# EAGLE schematic lab5 (EAGLE 9.6.2)
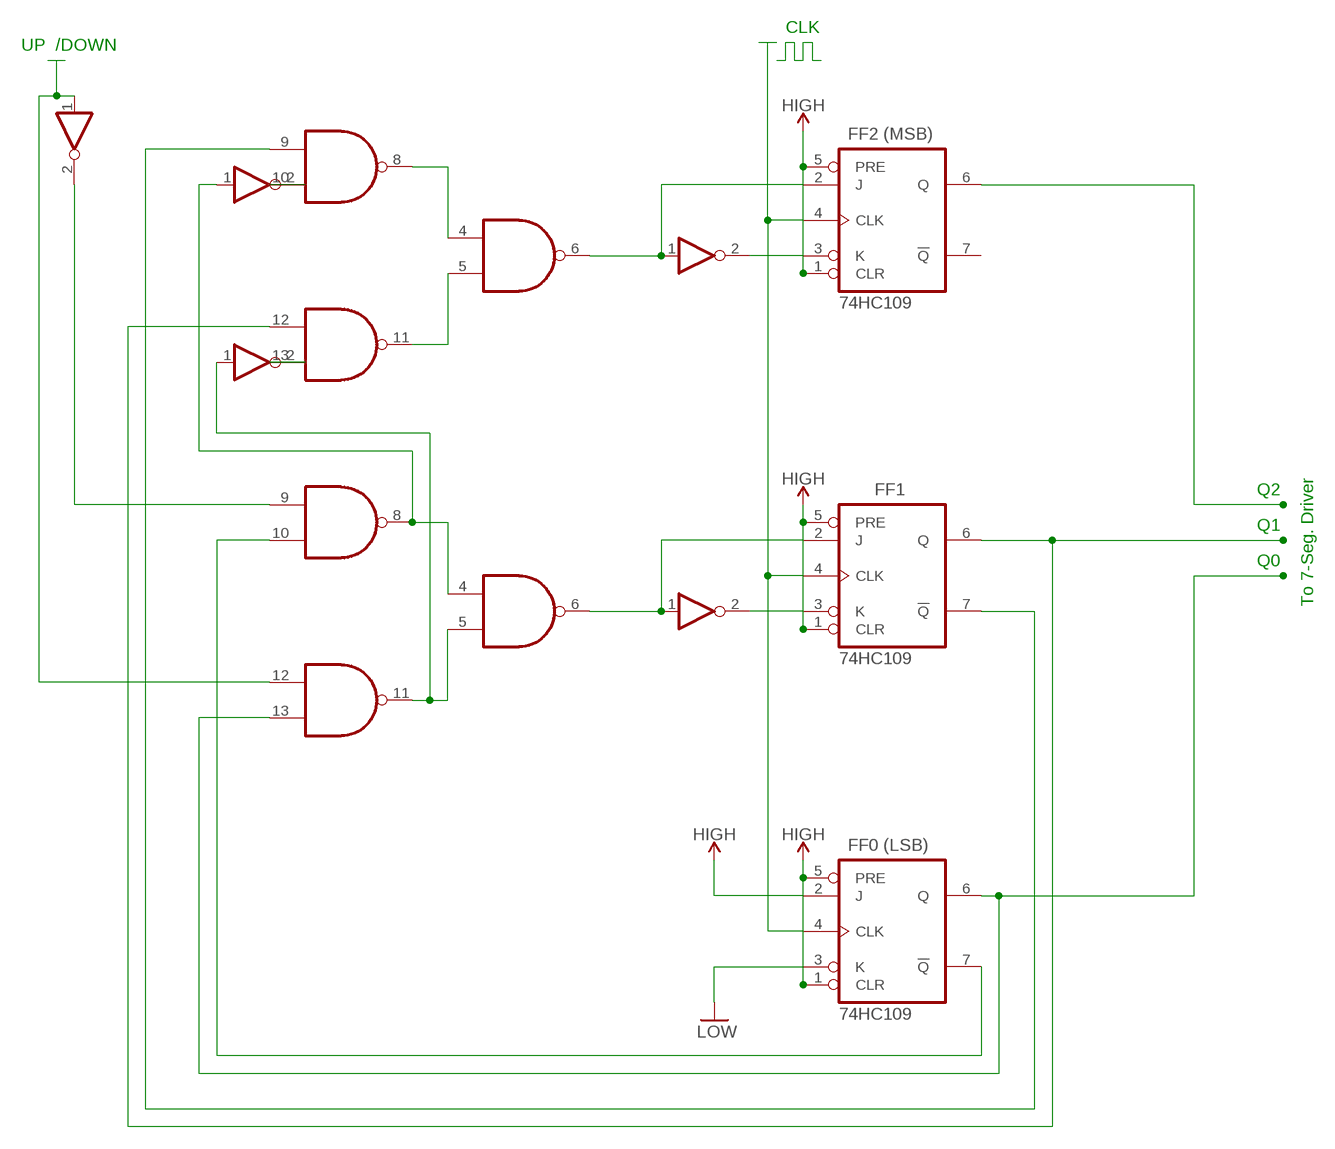
[diagram p0: schematic, sheet 1, part 1 of 2]
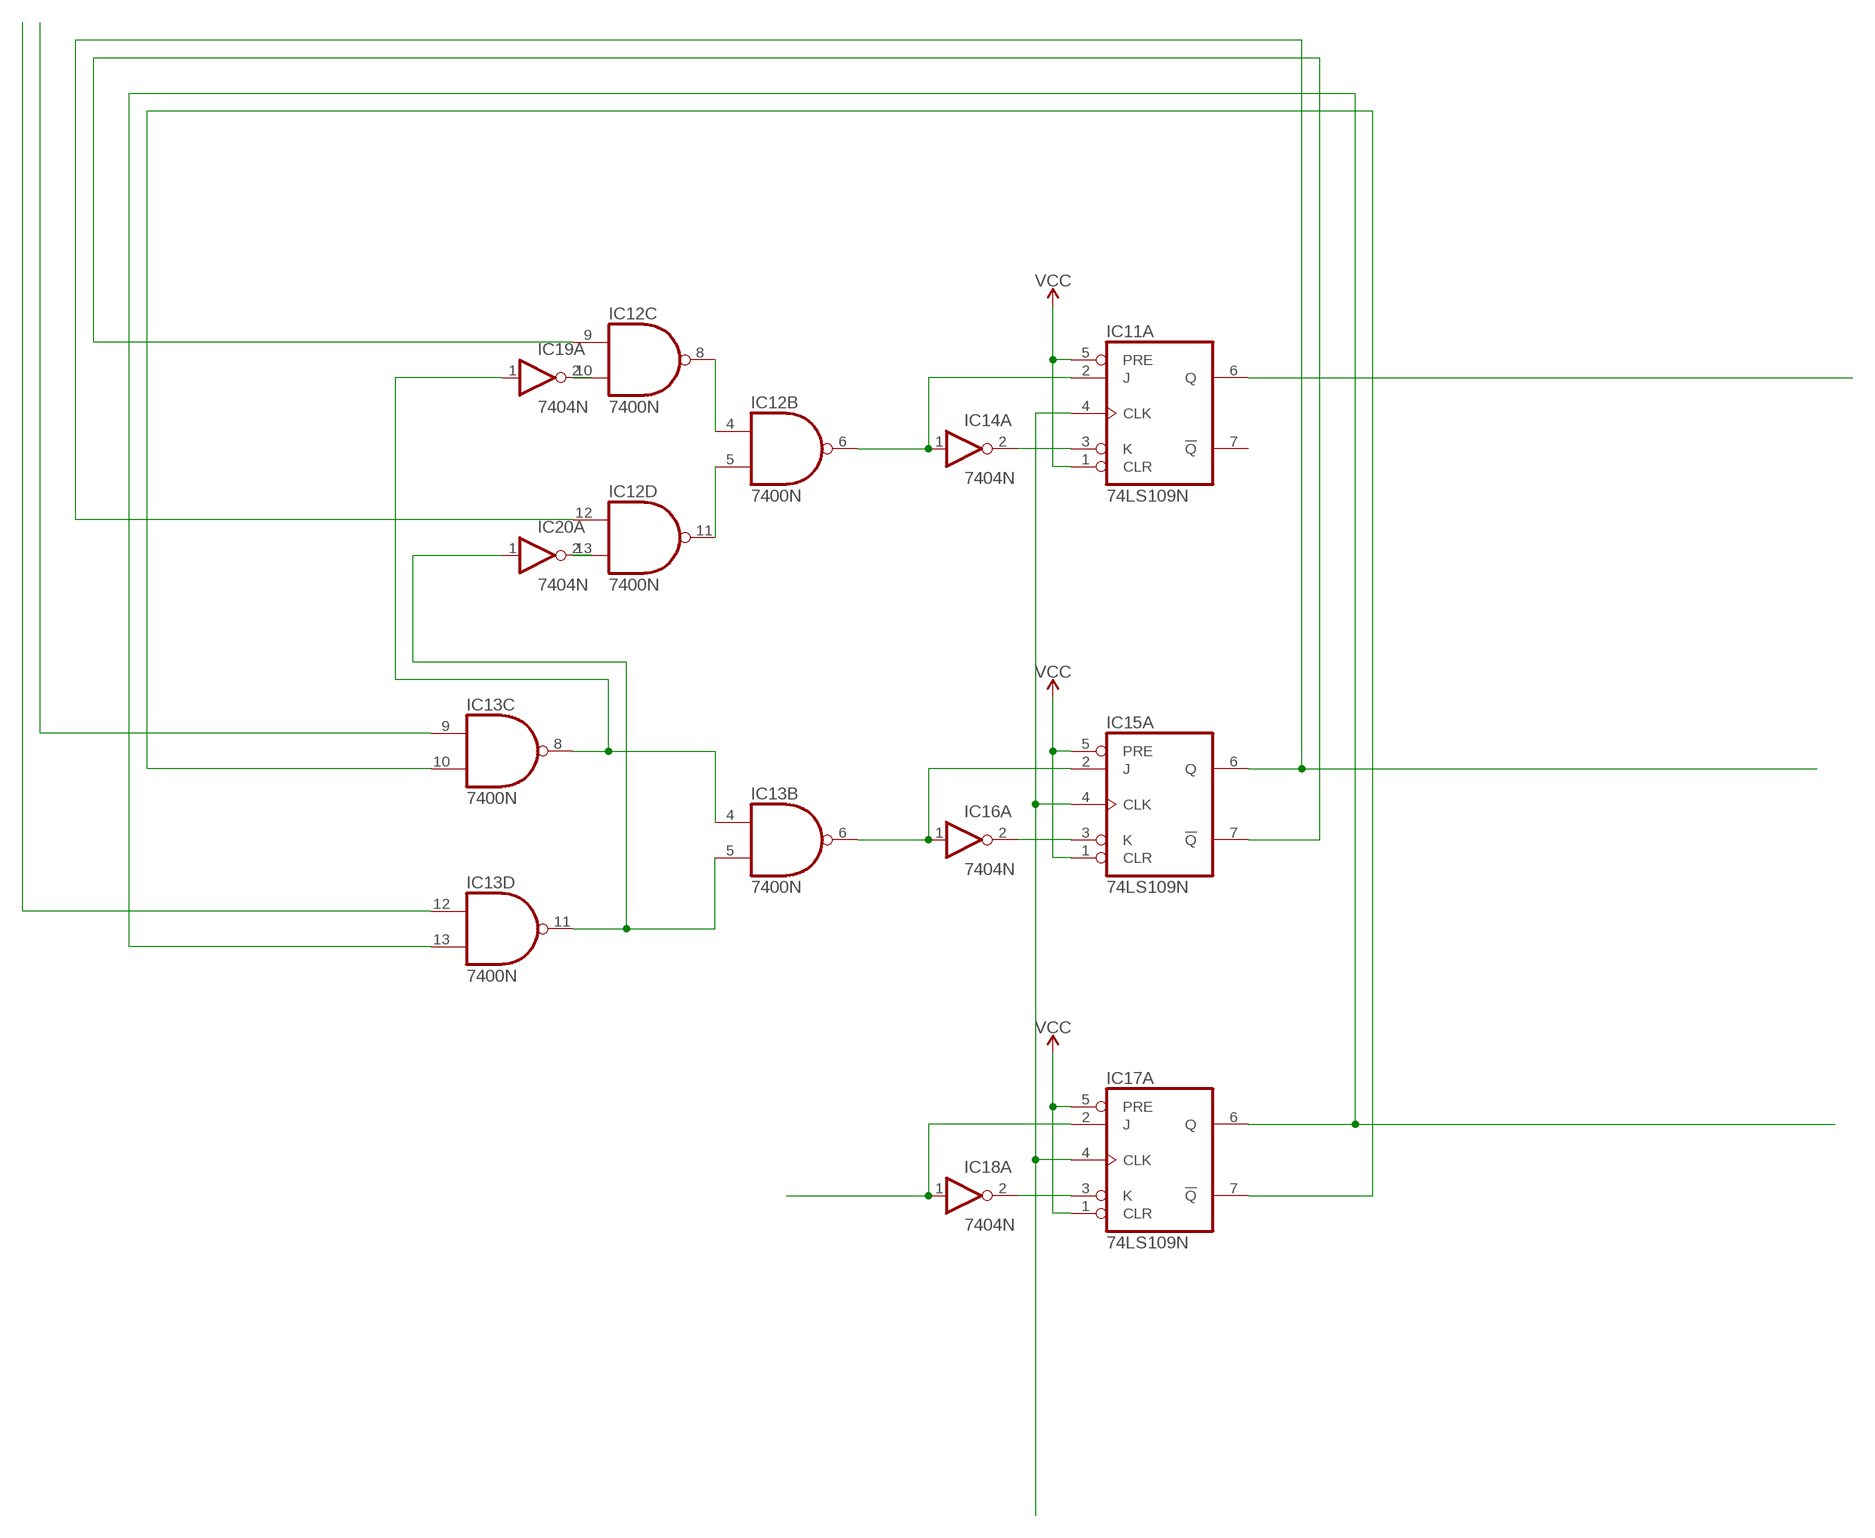
[diagram p1: schematic, sheet 1, part 2 of 2]

## Parts
FF0(LSB)  74HC109  74LS109N  [DIL16]
FF1  74HC109  74LS109N  [DIL16]
FF2(MSB)  74HC109  74LS109N  [DIL16]
IC2  7400N  [DIL14]
IC4  7404N  [DIL14]
IC7  7400N  [DIL14]
IC8  7404N  [DIL14]
IC9  7404N  [DIL14]
IC10  7404N  [DIL14]
IC11  74LS109N  [DIL16]
IC12  7400N  [DIL14]
IC13  7400N  [DIL14]
IC14  7404N  [DIL14]
IC15  74LS109N  [DIL16]
IC16  7404N  [DIL14]
IC17  74LS109N  [DIL16]
IC18  7404N  [DIL14]
IC19  7404N  [DIL14]
IC20  7404N  [DIL14]
IC21  7404N  [DIL14]

## Nets
GND: FF0(LSB).3(A:K) ; supply symbol labelled LOW
N$1: FF0(LSB).4(A:CLK) FF1.4(A:CLK) FF2(MSB).4(A:CLK)
N$2: FF2(MSB).2(A:J) IC2.6(B:O) IC8.1(A:I)
N$3: FF2(MSB).3(A:K) IC8.2(A:O)
N$4: FF1.3(A:K) IC9.2(A:O)
N$5: IC2.10(C:I1) IC4.2(A:O)
N$6: FF1.2(A:J) IC7.6(B:O) IC9.1(A:I)
N$8: IC7.5(B:I1) IC7.11(D:O) IC10.1(A:I)
N$9: IC2.13(D:I1) IC10.2(A:O)
N$10: IC2.4(B:I0) IC2.8(C:O)
N$11: IC2.5(B:I1) IC2.11(D:O)
N$13: IC4.1(A:I) IC7.4(B:I0) IC7.8(C:O)
N$14: FF0(LSB).7(A:!Q) IC7.10(C:I1)
N$16: FF1.6(A:Q) IC2.12(D:I0)
N$17: FF1.7(A:!Q) IC2.9(C:I0)
N$18: FF0(LSB).6(A:Q) IC7.13(D:I1)
N$20: FF2(MSB).6(A:Q)
N$21: IC11.3(A:K) IC14.2(A:O)
N$22: IC11.4(A:CLK) IC15.4(A:CLK) IC17.4(A:CLK)
N$23: IC12.4(B:I0) IC12.8(C:O)
N$24: IC12.5(B:I1) IC12.11(D:O)
N$25: IC13.5(B:I1) IC13.11(D:O) IC20.1(A:I)
N$26: IC13.4(B:I0) IC13.8(C:O) IC19.1(A:I)
N$27: IC11.2(A:J) IC12.6(B:O) IC14.1(A:I)
N$28: IC15.3(A:K) IC16.2(A:O)
N$29: IC13.6(B:O) IC15.2(A:J) IC16.1(A:I)
N$30: IC17.3(A:K) IC18.2(A:O)
N$31: IC17.2(A:J) IC18.1(A:I)
N$32: IC12.10(C:I1) IC19.2(A:O)
N$33: IC12.13(D:I1) IC20.2(A:O)
N$34: IC13.12(D:I0)
N$35: IC13.9(C:I0)
N$36: IC12.12(D:I0) IC15.6(A:Q)
N$37: IC12.9(C:I0) IC15.7(A:!Q)
N$38: IC13.13(D:I1) IC17.6(A:Q)
N$39: IC13.10(C:I1) IC17.7(A:!Q)
N$40: IC11.6(A:Q)
N$44: IC7.9(C:I0) IC21.2(A:O)
N$45: IC7.12(D:I0) IC21.1(A:I)
VCC: FF0(LSB).1(A:CLR) FF0(LSB).2(A:J) FF0(LSB).5(A:PRE) FF1.1(A:CLR) FF1.5(A:PRE) FF2(MSB).1(A:CLR) FF2(MSB).5(A:PRE) IC11.1(A:CLR) IC11.5(A:PRE) IC15.1(A:CLR) IC15.5(A:PRE) IC17.1(A:CLR) IC17.5(A:PRE) ; supply symbol labelled HIGH
Unconnected: FF0(LSB).9(B:!Q) FF0(LSB).10(B:Q) FF0(LSB).11(B:PRE) FF0(LSB).12(B:CLK) FF0(LSB).13(B:K) FF0(LSB).14(B:J) FF0(LSB).15(B:CLR) FF1.9(B:!Q) FF1.10(B:Q) FF1.11(B:PRE) FF1.12(B:CLK) FF1.13(B:K) FF1.14(B:J) FF1.15(B:CLR) FF2(MSB).7(A:!Q) FF2(MSB).9(B:!Q) FF2(MSB).10(B:Q) FF2(MSB).11(B:PRE) FF2(MSB).12(B:CLK) FF2(MSB).13(B:K) FF2(MSB).14(B:J) FF2(MSB).15(B:CLR) IC2.1(A:I0) IC2.2(A:I1) IC2.3(A:O) IC4.3(B:I) IC4.4(B:O) IC4.5(C:I) IC4.6(C:O) IC4.8(D:O) IC4.9(D:I) IC4.10(E:O) IC4.11(E:I) IC4.12(F:O) IC4.13(F:I) IC7.1(A:I0) IC7.2(A:I1) IC7.3(A:O) IC8.3(B:I) IC8.4(B:O) IC8.5(C:I) IC8.6(C:O) IC8.8(D:O) IC8.9(D:I) IC8.10(E:O) IC8.11(E:I) IC8.12(F:O) IC8.13(F:I) IC9.3(B:I) IC9.4(B:O) IC9.5(C:I) IC9.6(C:O) IC9.8(D:O) IC9.9(D:I) IC9.10(E:O) IC9.11(E:I) IC9.12(F:O) IC9.13(F:I) IC10.3(B:I) IC10.4(B:O) IC10.5(C:I) IC10.6(C:O) IC10.8(D:O) IC10.9(D:I) IC10.10(E:O) IC10.11(E:I) IC10.12(F:O) IC10.13(F:I) IC11.7(A:!Q) IC11.9(B:!Q) IC11.10(B:Q) IC11.11(B:PRE) IC11.12(B:CLK) IC11.13(B:K) IC11.14(B:J) IC11.15(B:CLR) IC12.1(A:I0) IC12.2(A:I1) IC12.3(A:O) IC13.1(A:I0) IC13.2(A:I1) IC13.3(A:O) IC14.3(B:I) IC14.4(B:O) IC14.5(C:I) IC14.6(C:O) IC14.8(D:O) IC14.9(D:I) IC14.10(E:O) IC14.11(E:I) IC14.12(F:O) IC14.13(F:I) IC15.9(B:!Q) IC15.10(B:Q) IC15.11(B:PRE) IC15.12(B:CLK) IC15.13(B:K) IC15.14(B:J) IC15.15(B:CLR) IC16.3(B:I) IC16.4(B:O) IC16.5(C:I) IC16.6(C:O) IC16.8(D:O) IC16.9(D:I) IC16.10(E:O) IC16.11(E:I) IC16.12(F:O) IC16.13(F:I) IC17.9(B:!Q) IC17.10(B:Q) IC17.11(B:PRE) IC17.12(B:CLK) IC17.13(B:K) IC17.14(B:J) IC17.15(B:CLR) IC18.3(B:I) IC18.4(B:O) IC18.5(C:I) IC18.6(C:O) IC18.8(D:O) IC18.9(D:I) IC18.10(E:O) IC18.11(E:I) IC18.12(F:O) IC18.13(F:I) IC19.3(B:I) IC19.4(B:O) IC19.5(C:I) IC19.6(C:O) IC19.8(D:O) IC19.9(D:I) IC19.10(E:O) IC19.11(E:I) IC19.12(F:O) IC19.13(F:I) IC20.3(B:I) IC20.4(B:O) IC20.5(C:I) IC20.6(C:O) IC20.8(D:O) IC20.9(D:I) IC20.10(E:O) IC20.11(E:I) IC20.12(F:O) IC20.13(F:I) IC21.3(B:I) IC21.4(B:O) IC21.5(C:I) IC21.6(C:O) IC21.8(D:O) IC21.9(D:I) IC21.10(E:O) IC21.11(E:I) IC21.12(F:O) IC21.13(F:I)

## Notes on the sheet
- CLK
- UP  /DOWN
- FF2 (MSB)
- To 7-Seg. Driver
- FF1 | Q2
- Q1
- Q0
- FF0 (LSB)

## Power pins joined to a net without a drawn wire
GND: FF0(LSB).8(P:GND) FF1.8(P:GND) FF2(MSB).8(P:GND) IC2.7(P:GND) IC4.7(P:GND) IC7.7(P:GND) IC8.7(P:GND) IC9.7(P:GND) IC10.7(P:GND) IC11.8(P:GND) IC12.7(P:GND) IC13.7(P:GND) IC14.7(P:GND) IC15.8(P:GND) IC16.7(P:GND) IC17.8(P:GND) IC18.7(P:GND) IC19.7(P:GND) IC20.7(P:GND) IC21.7(P:GND)
VCC: FF0(LSB).16(P:VCC) FF1.16(P:VCC) FF2(MSB).16(P:VCC) IC2.14(P:VCC) IC4.14(P:VCC) IC7.14(P:VCC) IC8.14(P:VCC) IC9.14(P:VCC) IC10.14(P:VCC) IC11.16(P:VCC) IC12.14(P:VCC) IC13.14(P:VCC) IC14.14(P:VCC) IC15.16(P:VCC) IC16.14(P:VCC) IC17.16(P:VCC) IC18.14(P:VCC) IC19.14(P:VCC) IC20.14(P:VCC) IC21.14(P:VCC)

## Library data of the parts
FF0(LSB) FF1 FF2(MSB) IC11 IC15 IC17 = AAA74xx-us:74*109: Dual J-K positive edge triggered FLIP FLOP, preset and clear
IC2 IC7 IC12 IC13 = AAA74xx-us:74*00: Quad 2-input NAND gate
IC4 IC8-IC10 IC14 IC16 IC18-IC21 = AAA74xx-us:74*04: Hex INVERTER